# Altium schematic sheet Sheet3.SchDoc
size A3
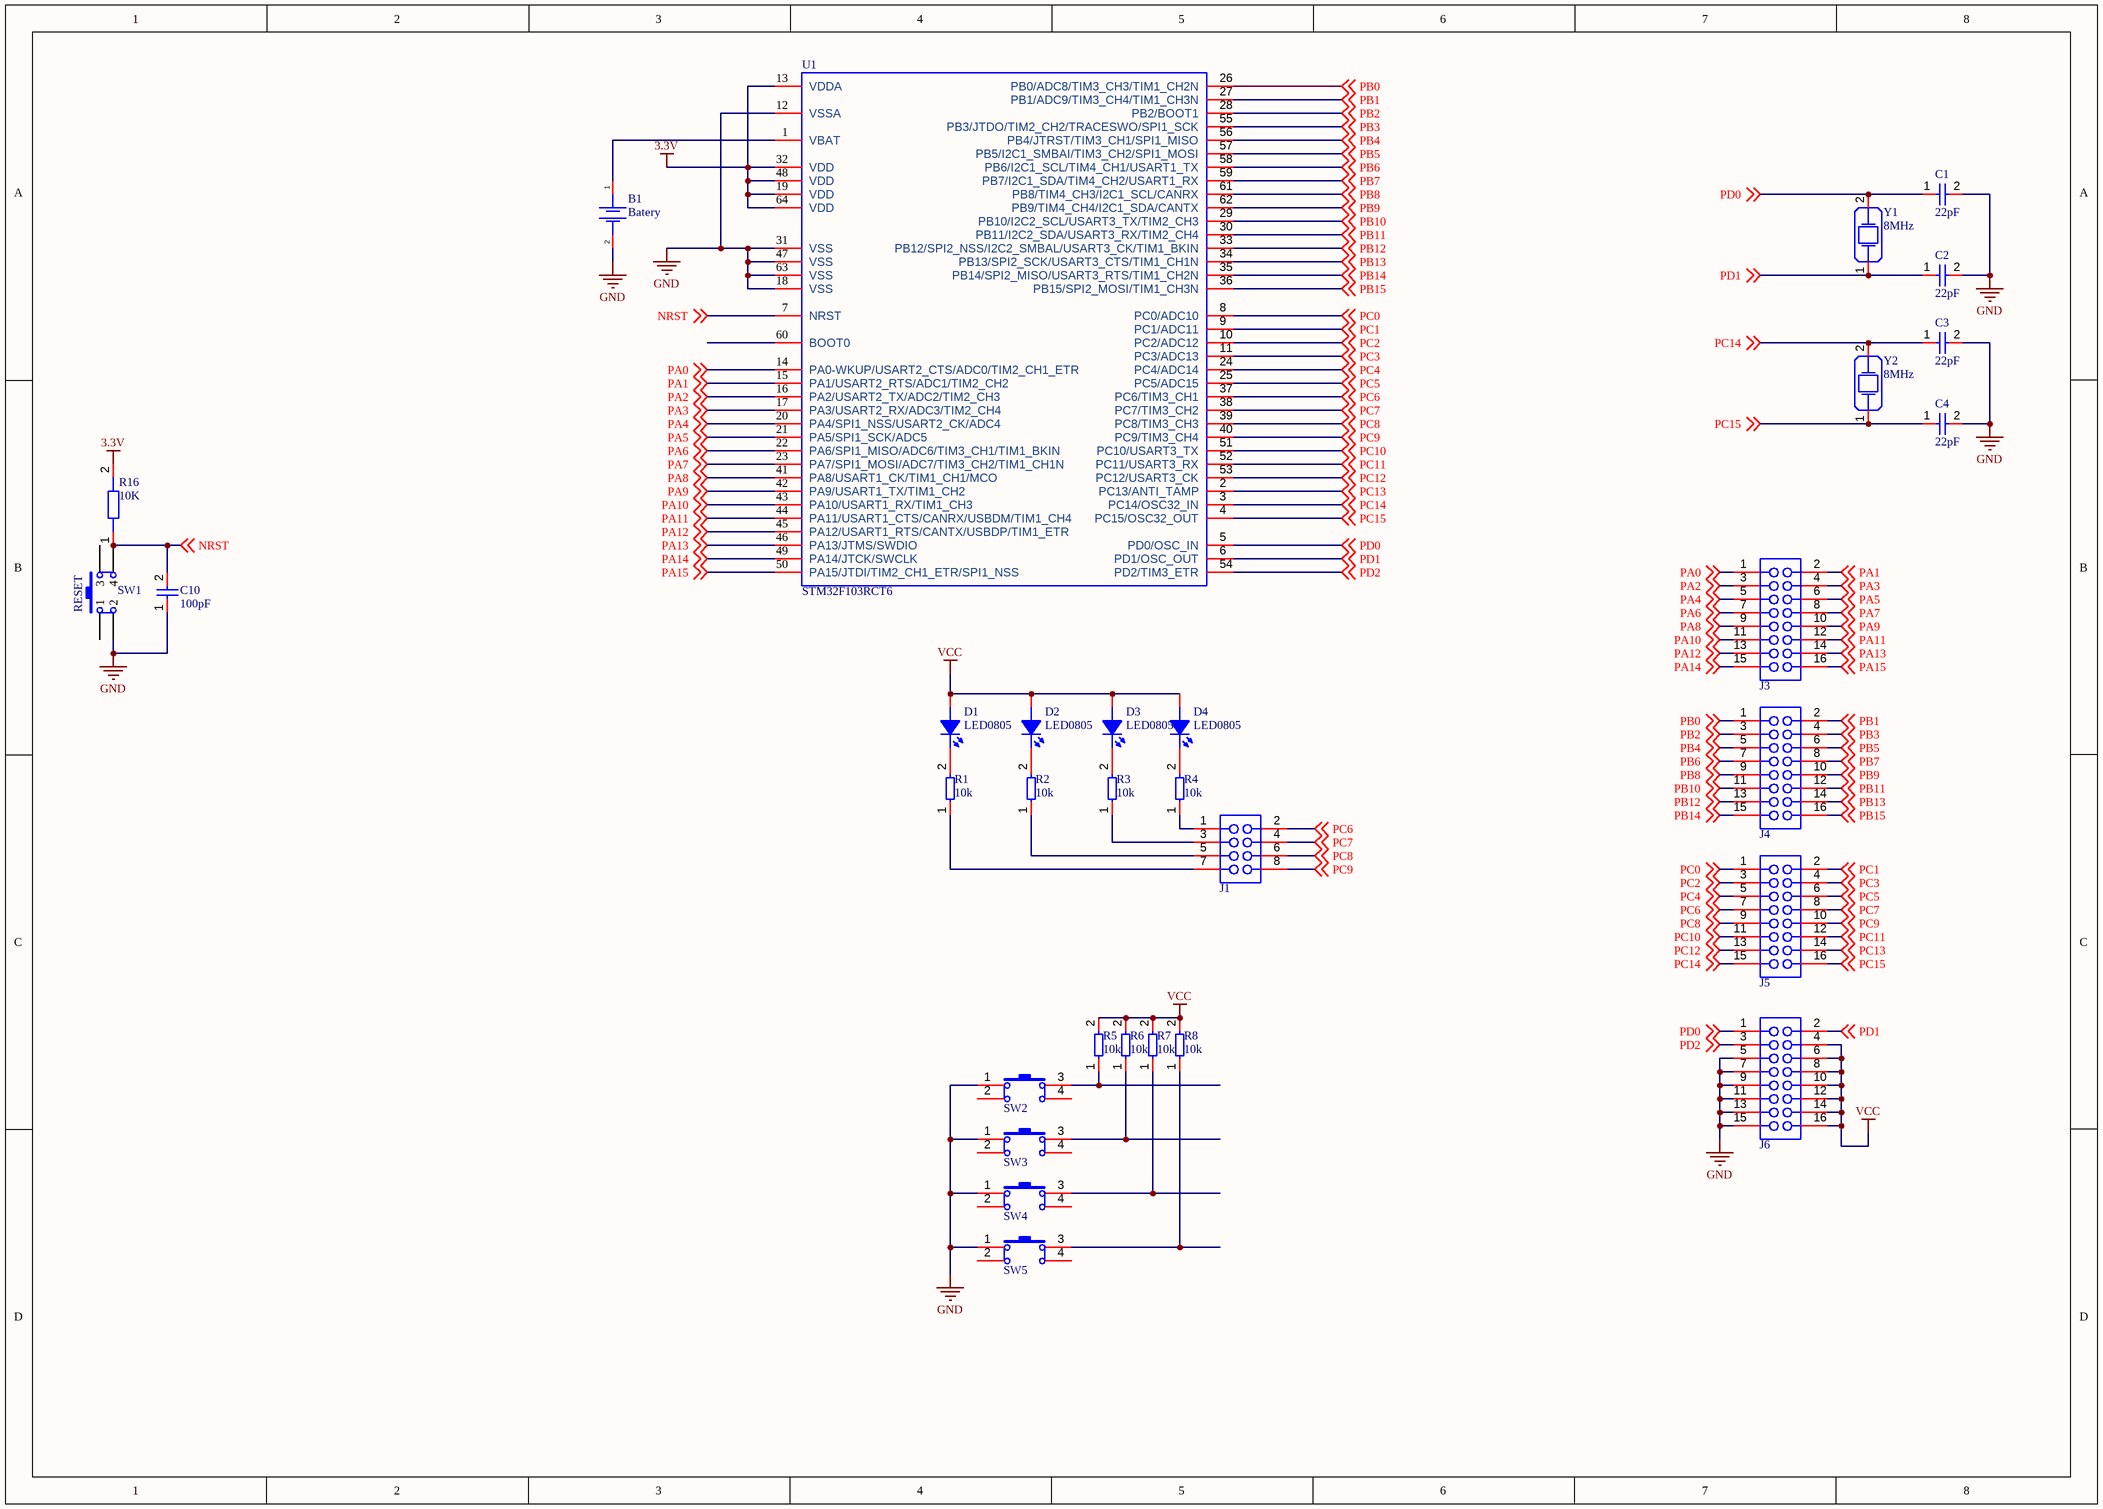
[diagram p0: Sheet3.SchDoc]

## Parts
B1  Batery  [CR1220]
C1  22pF  [C0805]
C2  22pF  [C0805]
C3  22pF  [C0805]
C4  22pF  [C0805]
C10  100pF  [CAP_DISC_PITCH_2.54MM]
D1  LED0805  [L0805RED]
D2  LED0805  [L0805RED]
D3  LED0805  [L0805RED]
D4  LED0805  [L0805RED]
J1  Header 4x2 TH Pitch 2.54mm  [Header 4x2 TH Pitch 2.54mm]  (value not drawn)
J3  Header 8x2 TH Pitch 2.54mm  [Header 8x2 TH Pitch 2.54mm]  (value not drawn)
J4  Header 8x2 TH Pitch 2.54mm  [Header 8x2 TH Pitch 2.54mm]  (value not drawn)
J5  Header 8x2 TH Pitch 2.54mm  [Header 8x2 TH Pitch 2.54mm]  (value not drawn)
J6  Header 8x2 TH Pitch 2.54mm  [Header 8x2 TH Pitch 2.54mm]  (value not drawn)
R1  10k  [R0805]
R2  10k  [R0805]
R3  10k  [R0805]
R4  10k  [R0805]
R5  10k  [R0805]
R6  10k  [R0805]
R7  10k  [R0805]
R8  10k  [R0805]
R16  10K  [RES-0.25W-H-MF]
SW1  RESET  [BUTTON_HOLE_5.0mm]
SW2  Button1  [BUTTON_HOLE_5.0mm]  (value not drawn)
SW3  Button1  [BUTTON_HOLE_5.0mm]  (value not drawn)
SW4  Button1  [BUTTON_HOLE_5.0mm]  (value not drawn)
SW5  Button1  [BUTTON_HOLE_5.0mm]  (value not drawn)
U1  STM32F103RCT6  [QFP64_0.5 SOCKET PINOUT]
Y1  8MHz  [SMD5032]
Y2  8MHz  [SMD5032]

## Nets
3.3V: R16.2 U1.13(VDDA) U1.19(VDD) U1.32(VDD) U1.48(VDD) U1.64(VDD)
GND: B1.2 C1.2 C2.2 C3.2 C4.2 C10.1 J6.5 J6.7 J6.9 J6.11 J6.13 J6.15 SW1.2 SW2.1 SW3.1 SW4.1 SW5.1 U1.12(VSSA) U1.18(VSS) U1.31(VSS) U1.47(VSS) U1.63(VSS)
VCC: D1.1(A) D2.1(A) D3.1(A) D4.1(A) J6.4 J6.6 J6.8 J6.10 J6.12 J6.14 J6.16 R5.2 R6.2 R7.2 R8.2
NRST: C10.2 R16.1 SW1.4 U1.7(NRST) ; off-sheet NRST
PA0: J3.1 U1.14(PA0-WKUP/USART2_CTS/ADC0/TIM2_CH1_ETR) ; off-sheet PA0
PA1: J3.2 U1.15(PA1/USART2_RTS/ADC1/TIM2_CH2) ; off-sheet PA1
PA2: J3.3 U1.16(PA2/USART2_TX/ADC2/TIM2_CH3) ; off-sheet PA2
PA3: J3.4 U1.17(PA3/USART2_RX/ADC3/TIM2_CH4) ; off-sheet PA3
PA4: J3.5 U1.20(PA4/SPI1_NSS/USART2_CK/ADC4) ; off-sheet PA4
PA5: J3.6 U1.21(PA5/SPI1_SCK/ADC5) ; off-sheet PA5
PA6: J3.7 U1.22(PA6/SPI1_MISO/ADC6/TIM3_CH1/TIM1_BKIN) ; off-sheet PA6
PA7: J3.8 U1.23(PA7/SPI1_MOSI/ADC7/TIM3_CH2/TIM1_CH1N) ; off-sheet PA7
PA8: J3.9 U1.41(PA8/USART1_CK/TIM1_CH1/MCO) ; off-sheet PA8
PA9: J3.10 U1.42(PA9/USART1_TX/TIM1_CH2) ; off-sheet PA9
PA10: J3.11 U1.43(PA10/USART1_RX/TIM1_CH3) ; off-sheet PA10
PA11: J3.12 U1.44(PA11/USART1_CTS/CANRX/USBDM/TIM1_CH4) ; off-sheet PA11
PA12: J3.13 U1.45(PA12/USART1_RTS/CANTX/USBDP/TIM1_ETR) ; off-sheet PA12
PA13: J3.14 U1.46(PA13/JTMS/SWDIO) ; off-sheet PA13
PA14: J3.15 U1.49(PA14/JTCK/SWCLK) ; off-sheet PA14
PA15: J3.16 U1.50(PA15/JTDI/TIM2_CH1_ETR/SPI1_NSS) ; off-sheet PA15
PB0: J4.1 U1.26(PB0/ADC8/TIM3_CH3/TIM1_CH2N) ; off-sheet PB0
PB1: J4.2 U1.27(PB1/ADC9/TIM3_CH4/TIM1_CH3N) ; off-sheet PB1
PB2: J4.3 U1.28(PB2/BOOT1) ; off-sheet PB2
PB3: J4.4 U1.55(PB3/JTDO/TIM2_CH2/TRACESWO/SPI1_SCK) ; off-sheet PB3
PB4: J4.5 U1.56(PB4/JTRST/TIM3_CH1/SPI1_MISO) ; off-sheet PB4
PB5: J4.6 U1.57(PB5/I2C1_SMBAI/TIM3_CH2/SPI1_MOSI) ; off-sheet PB5
PB6: J4.7 U1.58(PB6/I2C1_SCL/TIM4_CH1/USART1_TX) ; off-sheet PB6
PB7: J4.8 U1.59(PB7/I2C1_SDA/TIM4_CH2/USART1_RX) ; off-sheet PB7
PB8: J4.9 U1.61(PB8/TIM4_CH3/I2C1_SCL/CANRX) ; off-sheet PB8
PB9: J4.10 U1.62(PB9/TIM4_CH4/I2C1_SDA/CANTX) ; off-sheet PB9
PB10: J4.11 U1.29(PB10/I2C2_SCL/USART3_TX/TIM2_CH3) ; off-sheet PB10
PB11: J4.12 U1.30(PB11/I2C2_SDA/USART3_RX/TIM2_CH4) ; off-sheet PB11
PB12: J4.13 U1.33(PB12/SPI2_NSS/I2C2_SMBAL/USART3_CK/TIM1_BKIN) ; off-sheet PB12
PB13: J4.14 U1.34(PB13/SPI2_SCK/USART3_CTS/TIM1_CH1N) ; off-sheet PB13
PB14: J4.15 U1.35(PB14/SPI2_MISO/USART3_RTS/TIM1_CH2N) ; off-sheet PB14
PB15: J4.16 U1.36(PB15/SPI2_MOSI/TIM1_CH3N) ; off-sheet PB15
PC0: J5.1 U1.8(PC0/ADC10) ; off-sheet PC0
PC1: J5.2 U1.9(PC1/ADC11) ; off-sheet PC1
PC2: J5.3 U1.10(PC2/ADC12) ; off-sheet PC2
PC3: J5.4 U1.11(PC3/ADC13) ; off-sheet PC3
PC4: J5.5 U1.24(PC4/ADC14) ; off-sheet PC4
PC5: J5.6 U1.25(PC5/ADC15) ; off-sheet PC5
PC6: J1.2 J5.7 U1.37(PC6/TIM3_CH1) ; off-sheet PC6
PC7: J1.4 J5.8 U1.38(PC7/TIM3_CH2) ; off-sheet PC7
PC8: J1.6 J5.9 U1.39(PC8/TIM3_CH3) ; off-sheet PC8
PC9: J1.8 J5.10 U1.40(PC9/TIM3_CH4) ; off-sheet PC9
PC10: J5.11 U1.51(PC10/USART3_TX) ; off-sheet PC10
PC11: J5.12 U1.52(PC11/USART3_RX) ; off-sheet PC11
PC12: J5.13 U1.53(PC12/USART3_CK) ; off-sheet PC12
PC13: J5.14 U1.2(PC13/ANTI_TAMP) ; off-sheet PC13
PC14: C3.1 J5.15 U1.3(PC14/OSC32_IN) Y2.2 ; off-sheet PC14
PC15: C4.1 J5.16 U1.4(PC15/OSC32_OUT) Y2.1 ; off-sheet PC15
PD0: C1.1 J6.1 U1.5(PD0/OSC_IN) Y1.2 ; off-sheet PD0
PD1: C2.1 J6.2 U1.6(PD1/OSC_OUT) Y1.1 ; off-sheet PD1
PD2: J6.3 U1.54(PD2/TIM3_ETR) ; off-sheet PD2
NetB1_1: B1.1 U1.1(VBAT)
NetD1_2: D1.2(K) R1.2
NetD2_2: D2.2(K) R2.2
NetD3_2: D3.2(K) R3.2
NetD4_2: D4.2(K) R4.2
NetJ1_1: J1.1 R4.1
NetJ1_3: J1.3 R3.1
NetJ1_5: J1.5 R2.1
NetJ1_7: J1.7 R1.1
NetR5_1: R5.1 SW2.3
NetR6_1: R6.1 SW3.3
NetR7_1: R7.1 SW4.3
NetR8_1: R8.1 SW5.3

Not connected (* = marked no-connect by the designer): SW1 1 3; SW2 2 4; SW3 2 4; SW4 2 4; SW5 2 4; U1 60(BOOT0)

## Library data of the parts
C1-C4 = Capacitors(SMD)
C10 = Capacitors(Disc)
R1-R8 = Resistor SMD
R16 = Resistors THD
SW1 = Button
U1 = STM32F103RCT6: LQFP64
Y1 Y2 = Crystal